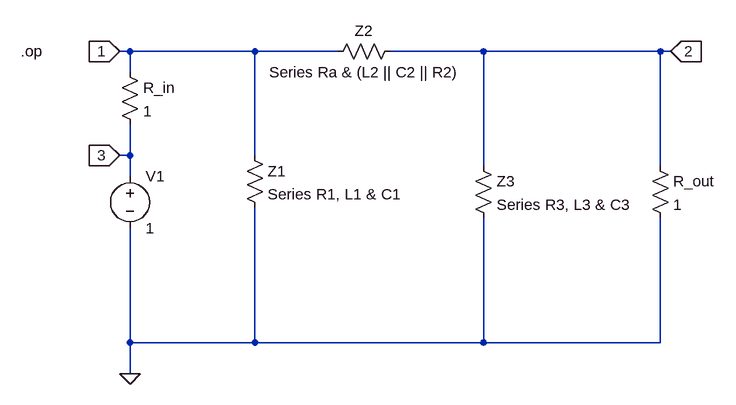
[diagram p0: schematic Pi-Filter-FACTS.asc]
Pi-Filter-FACTS.asc, the LTspice schematic file:
Version 4
SHEET 1 944 680
WIRE 32 16 16 16
WIRE 224 16 32 16
WIRE 352 16 224 16
WIRE 576 16 432 16
WIRE 848 16 576 16
WIRE 864 16 848 16
WIRE 32 48 32 16
WIRE 32 176 32 128
WIRE 32 176 16 176
WIRE 224 176 224 16
WIRE 576 192 576 16
WIRE 848 192 848 16
WIRE 32 208 32 176
WIRE 32 464 32 288
WIRE 224 464 224 256
WIRE 224 464 32 464
WIRE 576 464 576 272
WIRE 576 464 224 464
WIRE 848 464 848 272
WIRE 848 464 576 464
WIRE 32 512 32 464
FLAG 32 512 0
FLAG 16 16 1
IOPIN 16 16 In
FLAG 864 16 2
IOPIN 864 16 In
FLAG 16 176 3
IOPIN 16 176 In
SYMBOL voltage 32 192 R0
SYMATTR InstName V1
SYMATTR Value 1
SYMBOL res 16 32 R0
SYMATTR InstName R_in
SYMATTR Value 1
SYMBOL res 832 176 R0
SYMATTR InstName R_out
SYMATTR Value 1
SYMBOL res 208 160 R0
SYMATTR InstName Z1
SYMATTR Value Series R1, L1 & C1
SYMBOL res 448 0 R90
WINDOW 0 0 56 VBottom 2
WINDOW 3 32 56 VTop 2
SYMATTR InstName Z2
SYMATTR Value Series Ra & (L2 || C2 || R2)
SYMBOL res 560 176 R0
SYMATTR InstName Z3
SYMATTR Value Series R3, L3 & C3
TEXT -136 16 Left 2 !.op

The netlist it stands for:
* Pi-Filter-FACTS.asc
V1 3 0 1
R_in 1 3 1
R_out 2 0 1
R§Z1 1 0 Series R1, L1 & C1
R§Z2 2 1 Series Ra & (L2 || C2 || R2)
R§Z3 2 0 Series R3, L3 & C3
.op
.backanno
.end